# Altium schematic sheet MotherSheet.SchDoc
size A; SheetNumber: 1; SheetTotal: 5
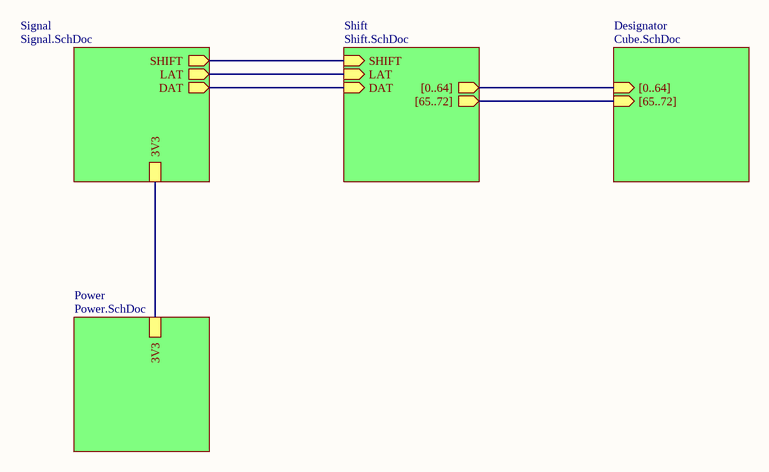
[diagram p0: MotherSheet.SchDoc]

## Sub-sheets
Designator = Cube.SchDoc: [0..64] (in), [65..72] (in)
Power = Power.SchDoc: 3V3
Shift = Shift.SchDoc: SHIFT (in), LAT (in), DAT (in), [0..64] (out), [65..72] (out)
Signal = Signal.SchDoc: 3V3, DAT (out), LAT (out), SHIFT (out)

## Nets
(unnamed): sheet Signal/3V3, sheet Power/3V3
(unnamed): sheet Signal/DAT, sheet Shift/DAT
(unnamed): sheet Signal/LAT, sheet Shift/LAT
(unnamed): sheet Signal/SHIFT, sheet Shift/SHIFT

## Buses and harness runs
bus sheet Designator/[0..64] = sheet Shift/[0..64]
bus sheet Designator/[65..72] = sheet Shift/[65..72]